# Altium schematic sheet LTE.SchDoc
size A3
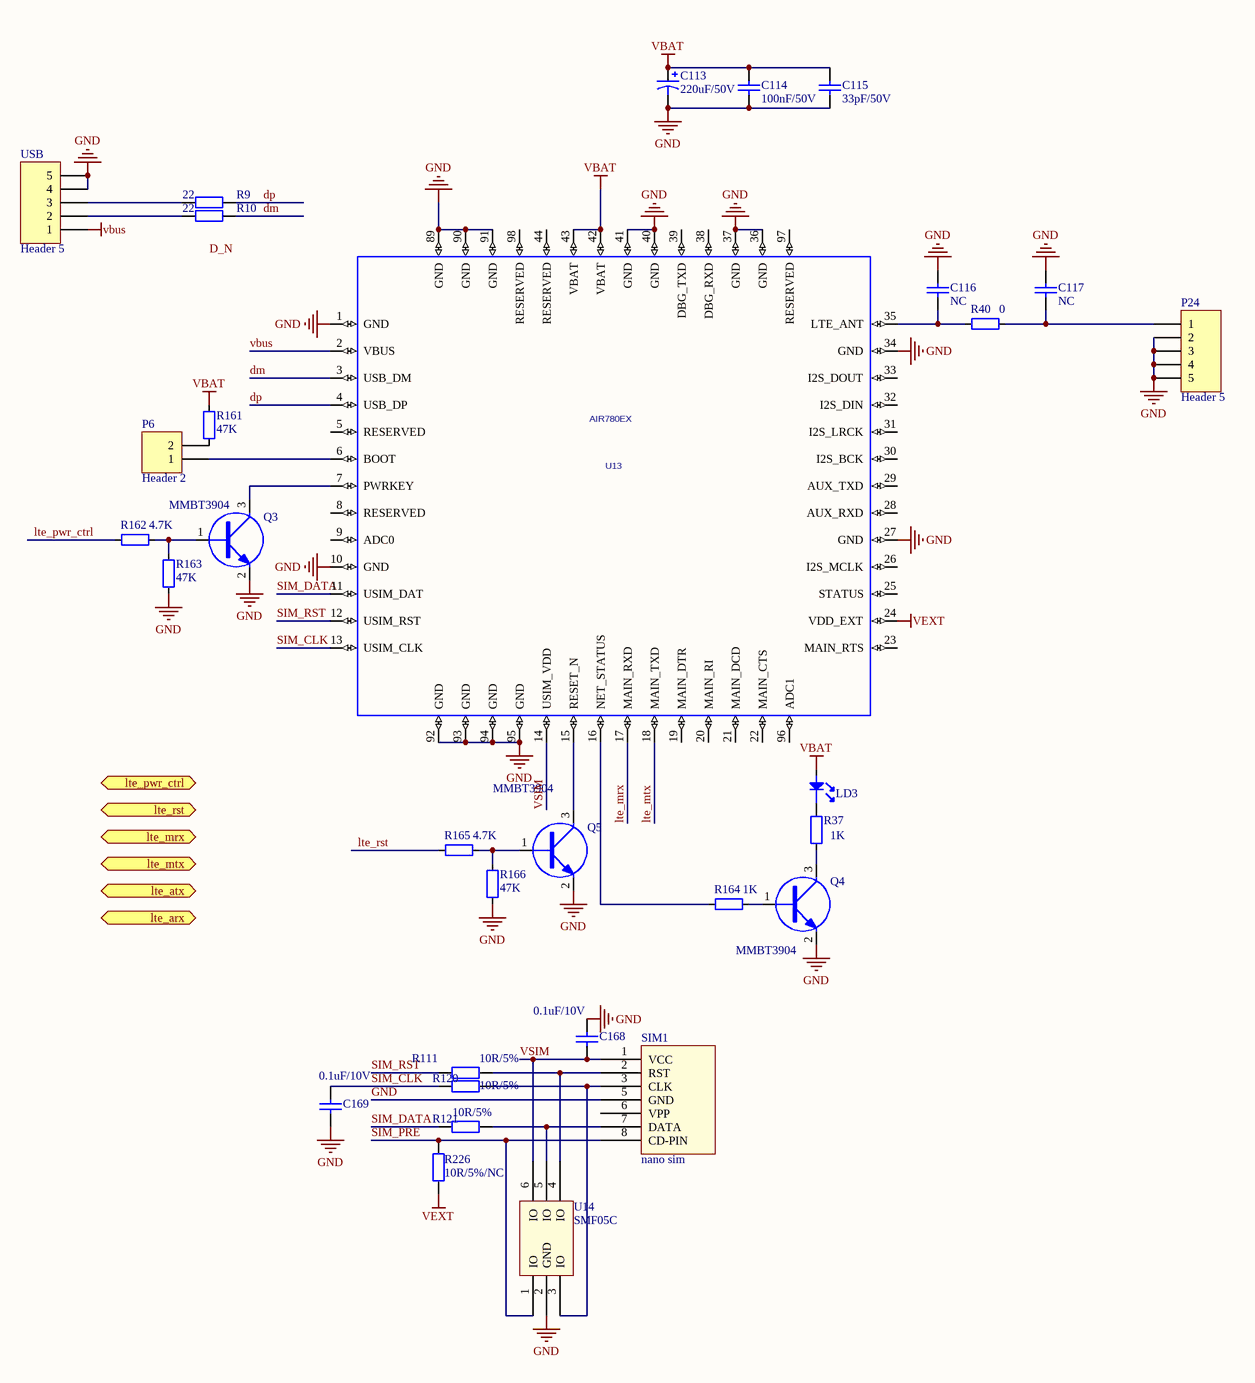
[diagram p0: LTE.SchDoc]

## Parts
C113  220uF/50V  [Φ10×10]
C114  100nF/50V  [0603C]
C115  33pF/50V  [0603C]
C116  NC  [0603c]
C117  NC  [0603c]
C168  0.1uF/10V  [0603c]
C169  0.1uF/10V  [0603c]
LD3  LED_Green_19-217  [0603led]  (value not drawn)
P6  Header 2  [HDR1X2]
P24  Header 5  [KH-SMA-KE-Z]
Q3  MMBT3904  [SOT23-3]
Q4  MMBT3904  [SOT23-3]
Q5  MMBT3904  [SOT23-3]
R9  22  [0402R]
R10  22  [0402R]
R37  1K  [0603R]
R40  0  [0603r]
R111  10R/5%  [0603r]
R120  10R/5%  [0603r]
R121  10R/5%  [0603r]
R161  47K  [0603r]
R162  4.7K  [0603R]
R163  47K  [0603r]
R164  1K  [0603r]
R165  4.7K  [0603R]
R166  47K  [0603r]
R226  10R/5%/NC  [0603r]
SIM1  nano sim  [Nano SIM]
U13  AIR780EX  [AIR780EX]
U14  SMF05C  [sc70-6l]
USB  Header 5  [USB-MICRO-5P]

## Ports
lte_arx, lte_atx, lte_mrx, lte_mtx, lte_pwr_ctrl, lte_rst

## Nets
GND: C113.2 C114.1 C115.1 C116.2 C117.2 C168.1 C169.2 P24.2 P24.3 P24.4 P24.5 Q3.2(E) Q4.2(E) Q5.2(E) R163.1 R166.1 SIM1.5(GND) U13.1(GND) U13.10(GND) U13.27(GND) U13.34(GND) U13.36(GND) U13.37(GND) U13.40(GND) U13.41(GND) U13.89(GND) U13.90(GND) U13.91(GND) U13.92(GND) U13.93(GND) U13.94(GND) U13.95(GND) U14.2(GND) USB.4 USB.5
VBAT: C113.1 C114.2 C115.2 LD3.1 R161.2 U13.42(VBAT) U13.43(VBAT)
vbus: U13.2(VBUS) USB.1
VEXT: R226.2 U13.24(VDD_EXT)
dm: R10.2 U13.3(USB_DM)
dp: R9.2 U13.4(USB_DP)
lte_mrx: U13.17(MAIN_RXD)
lte_mtx: U13.18(MAIN_TXD)
lte_pwr_ctrl: R162.1
lte_rst: R165.1
SIM_CLK: C169.1 R120.2 U13.13(USIM_CLK)
SIM_DATA: R121.2 U13.11(USIM_DAT)
SIM_PRE: R226.1 SIM1.8(CD-PIN) U14.1(IO)
SIM_RST: R111.2 U13.12(USIM_RST)
VSIM: C168.2 SIM1.1(VCC) U13.14(USIM_VDD) U14.6(IO)
NetC116_1: C116.1 R40.1 U13.35(LTE_ANT)
NetC117_1: C117.1 P24.1 R40.2
NetLD3_2: LD3.2 R37.1
NetP6_1: P6.1 U13.6(BOOT)
NetP6_2: P6.2 R161.1
NetQ3_1: Q3.1(B) R162.2 R163.2
NetQ3_3: Q3.3(C) U13.7(PWRKEY)
NetQ4_1: Q4.1(B) R164.2
NetQ4_3: Q4.3(C) R37.2
NetQ5_1: Q5.1(B) R165.2 R166.2
NetQ5_3: Q5.3(C) U13.15(RESET_N)
NetR9_1: R9.1 USB.3
NetR10_1: R10.1 USB.2
NetR111_1: R111.1 SIM1.2(RST) U14.4(IO)
NetR120_1: R120.1 SIM1.3(CLK) U14.3(IO)
NetR121_1: R121.1 SIM1.7(DATA) U14.5(IO)
NetR164_1: R164.1 U13.16(NET_STATUS)

Not connected (* = marked no-connect by the designer): SIM1 6(VPP); U13 5(RESERVED) 8(RESERVED) 9(ADC0) 19(MAIN_DTR) 20(MAIN_RI) 21(MAIN_DCD) 22(MAIN_CTS) 23(MAIN_RTS) 25(STATUS) 26(I2S_MCLK) 28(AUX_RXD) 29(AUX_TXD) 30(I2S_BCK) 31(I2S_LRCK) 32(I2S_DIN) 33(I2S_DOUT) 38(DBG_RXD) 39(DBG_TXD) 44(RESERVED) 96(ADC1) 97(RESERVED) 98(RESERVED)

## Notes on the sheet
- Labels drawn without touching a wire or pin: D_N

## Library data of the parts
C113 = Cap Pol1: Polarized Capacitor (Radial); Value: 100pF; Published: 8-Jun-2000; LatestRevisionDate: 17-Jul-2002; LatestRevisionNote: Re-released for DXP Platform.; PackageReference: RB7.6-15; Publisher: Altium Limited
C114-C117 = Cap: Capacitor; Value: 22nF; Published: 8-Jun-2000; LatestRevisionDate: 17-Jul-2002; LatestRevisionNote: Re-released for DXP Platform.; PackageReference: RAD-0.3; Publisher: Altium Limited; PackageDescription: Radial Cap, Thru-Hole; 2 Leads; 0.3 in Pin Spacing
C168 C169 = Cap: Capacitor; Published: 8-Jun-2000; LatestRevisionDate: 17-Jul-2002; LatestRevisionNote: Re-released for DXP Platform.; PackageReference: RAD-0.3; Publisher: Altium Limited; Value: 0.1uF/10V
LD3 = LED_Green_19-217: 物料主编码(PN): 100000032; Value: 19-217/G7C-AN1P2/3T; ID: 6; 序号: 33; 物料名称: 绿色LED; 物料描述: Other,LED,绿色,0603,1.6X0.8X0.4mm,19-217/G7C-AN1P2/3T; 工作温度: –40°C to 85°C; 制造商: Everlight; 器件等级: ——; 物料类型: 特殊二极管; 规格型号(完整型号): 19-217/G7C-AN1P2/3T
P6 = Header 2: Header, 2-Pin; LatestRevisionDate: 17-Jul-2002; LatestRevisionNote: Re-released for DXP Platform.; Publisher: Altium Limited
P24 USB = Header 5: Header, 5-Pin; LatestRevisionDate: 17-Jul-2002; LatestRevisionNote: Re-released for DXP Platform.; Publisher: Altium Limited
Q3-Q5 = NPN_MMBT3904
R9 R10 = Resistor: Resistor SMD - IEC symbol version; Value: NC; LatestRevisionDate: 27-Jul-20  -  Semtech
R37 R164 = RES0603: 物料主编码(PN): 150000040; ID: 233; 序号: 109; 物料名称: 贴片电阻; 精度: ±1%; 规格型号(完整型号): RC1608F103CS/RC0603FR-0710KL; 物料描述: RES,贴片电阻,0603,10k,±1%,1/10W,1.6X0.8X0.45mm,RC1608F103CS/RC0603FR-0710KL; 工作温度: –55°C to 155°C; 制造商: 三星/YAGEO; 器件等级: ——; 物料类型: 表贴电阻; 参数值: 1.00E+04; Value: 1K
R40 R161-R163 R165 R166 = RES0603: 物料主编码(PN): 150000040; Value: 1K; ID: 233; 序号: 109; 物料名称: 贴片电阻; 精度: ±1%; 规格型号(完整型号): RC1608F103CS/RC0603FR-0710KL; 物料描述: RES,贴片电阻,0603,10k,±1%,1/10W,1.6X0.8X0.45mm,RC1608F103CS/RC0603FR-0710KL; 工作温度: –55°C to 155°C; 制造商: 三星/YAGEO; 器件等级: ——; 物料类型: 表贴电阻; 参数值: 1.00E+04
R111 R120 R121 R226 = Res2: Resistor; Value: 10R; Published: 8-Jun-2000; LatestRevisionDate: 17-Jul-2002; LatestRevisionNote: Re-released for DXP Platform.; PackageReference: AXIAL-0.4; Publisher: Altium Limited
U13 = AIR780EX: PCB DECAL: AIR780EX